# EAGLE design UV_Controller (EAGLE 9.6.2)
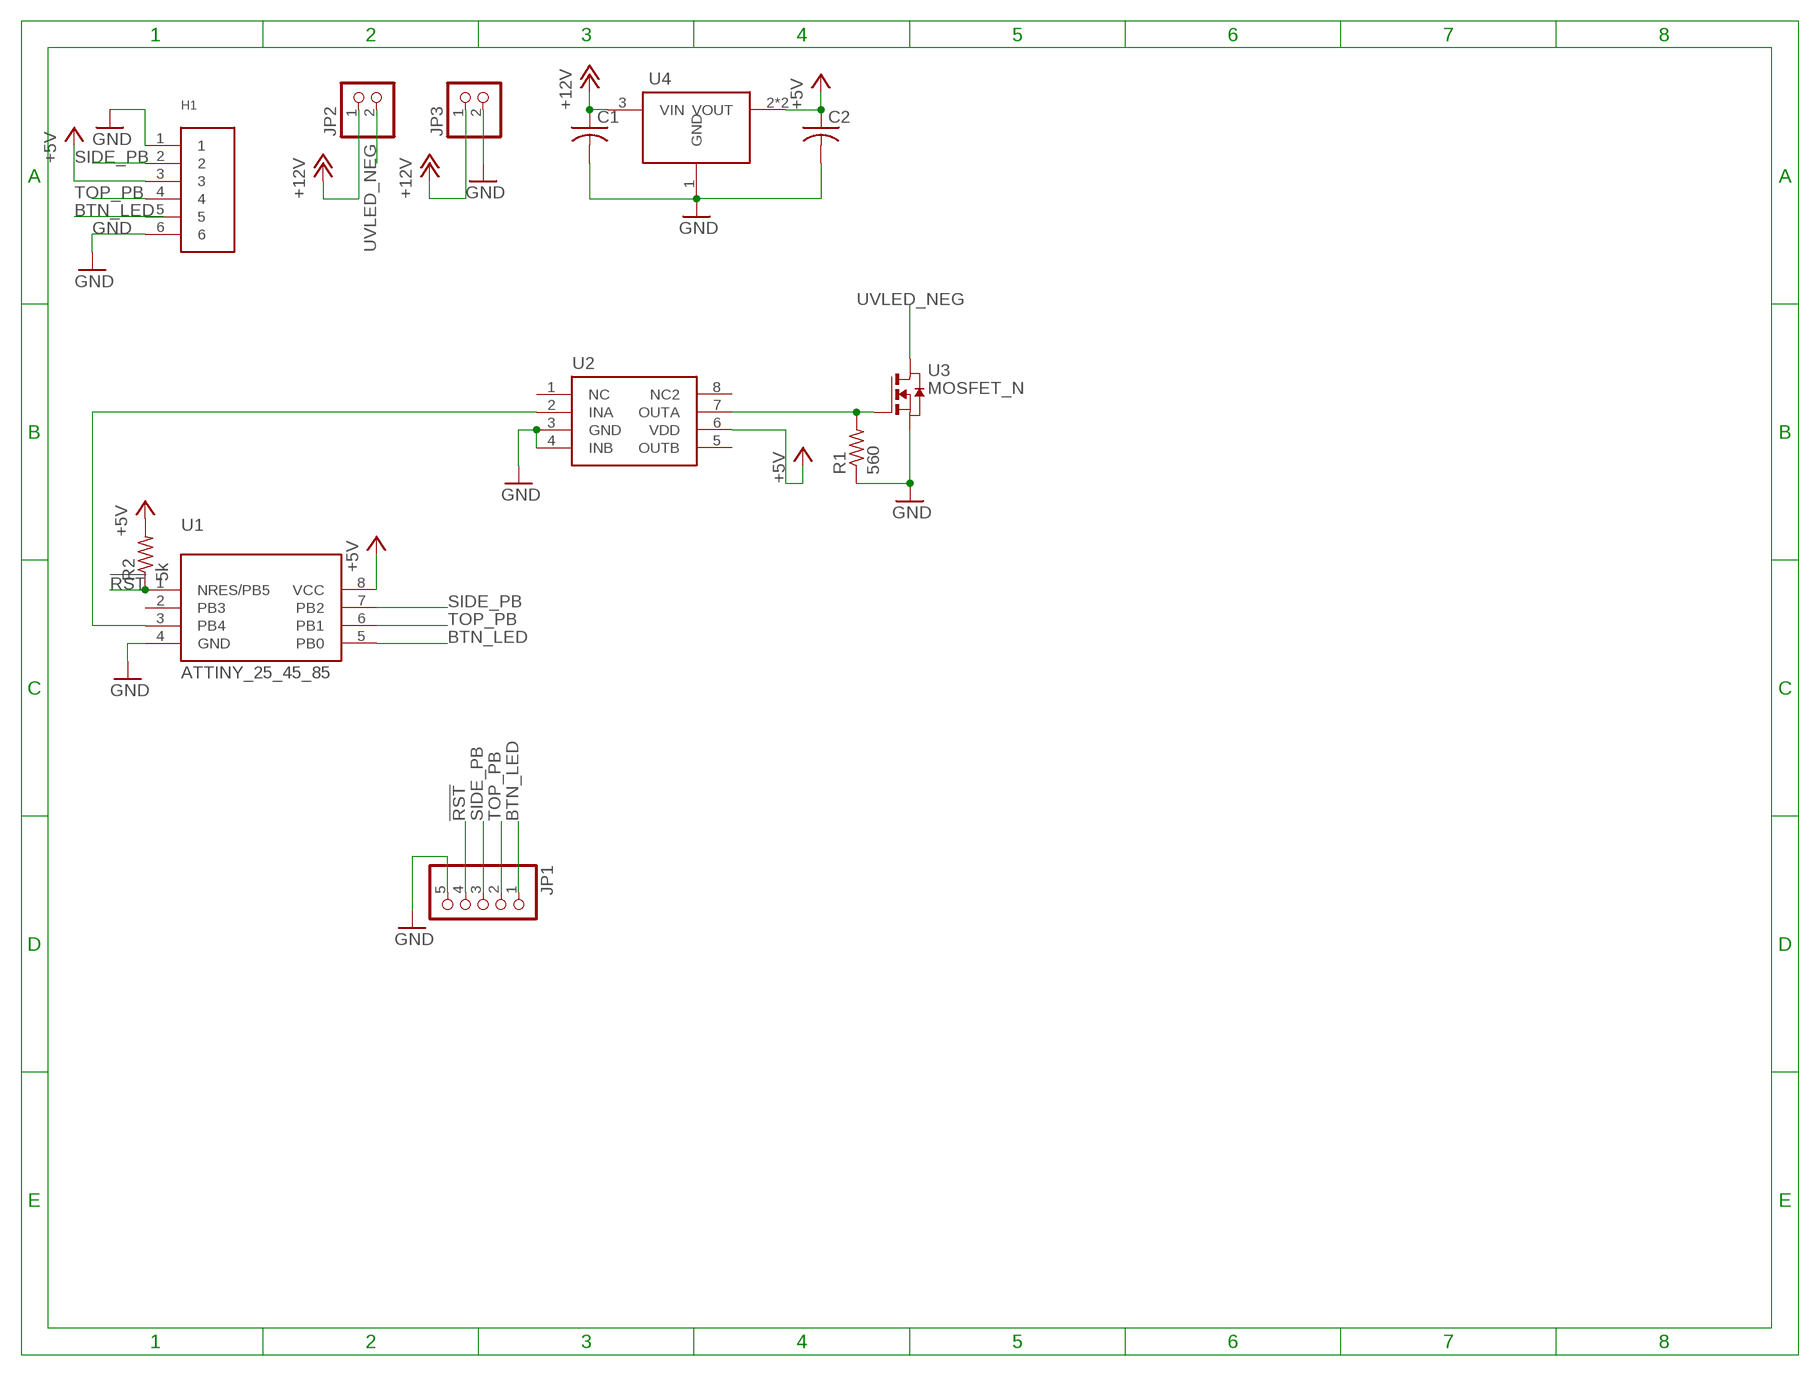
[diagram p0: schematic, sheet 1]

## Parts
C1  C-USC0805  [C0805]
C2  C-USC0805  [C0805]
H1  6PIN_RIBBON_CONN_1MM  [6PIN_SMD_CONN_1MM]
JP1  PINHD-1X5  [1X05]
JP2  PINHD-1X2  [1X02]
JP3  PINHD-1X2  [1X02]
R1  560  R-US_R0805  [R0805]
R2  5k  R-US_R0805  [R0805]
U1  ATTINY_25_45_85  [SOIC-8]
U2  TC427  [SOIC-8]
U3  MOSFET_N  [SOT-23]
U4  NCP1117ST50T3G  [SOT223]

## Nets
!RST: JP1.4 R2.1 U1.1(NRES/PB5)
+5V: C2.1 H1.3 R2.2 U1.8(VCC) U2.6(VDD) U4.2(VOUT) U4.4(VOUT)
+12V: C1.1 JP2.1 JP3.1 U4.3(VIN)
BTN_LED: H1.5 JP1.1 U1.5(PB0)
GND: C1.2 C2.2 H1.1 H1.6 JP1.5 JP3.2 R1.1 U1.4(GND) U2.3(GND) U2.4(INB) U3.3(S) U4.1(GND)
N$1: U1.3(PB4) U2.2(INA)
N$3: R1.2 U2.7(OUTA) U3.2(G)
SIDE_PB: H1.2 JP1.3 U1.7(PB2)
TOP_PB: H1.4 JP1.2 U1.6(PB1)
UVLED_NEG: JP2.2 U3.1(D)
Unconnected: U1.2(PB3) U2.1(NC) U2.5(OUTB) U2.8(NC2)

## Library data of the parts
C1 C2 = DR:C-US: CAPACITOR, American symbol
H1 = DR:6PIN_RIBBON_CONN_1MM
JP1 = pinhead:PINHD-1X5: PIN HEADER
JP2 JP3 = pinhead:PINHD-1X2: PIN HEADER
R1 R2 = DR:R-US_: RESISTOR, American symbol
U1 = DR:ATTINY_25_45_85
U2 = DR:TC427
U3 = DR:MOSFET_N
U4 = DR:NCP1117ST50T3G

## Board
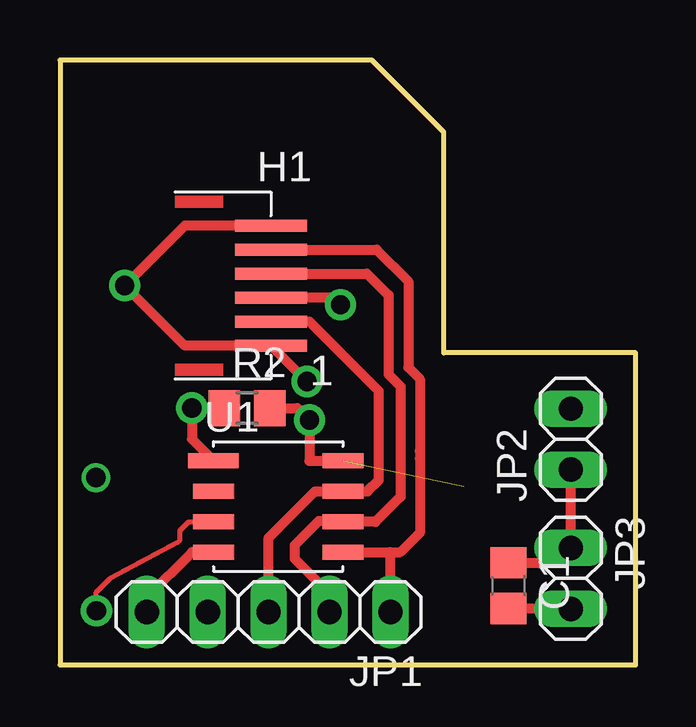
[diagram p1: board, top side]
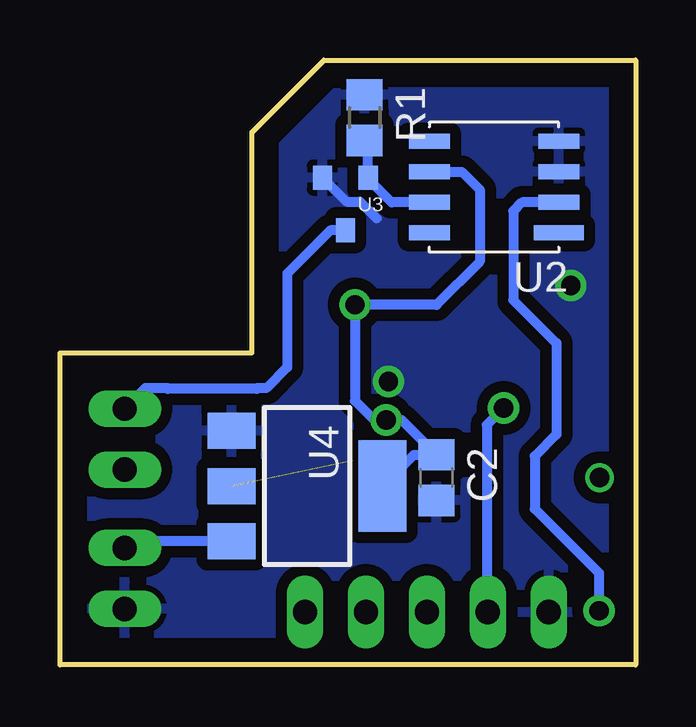
[diagram p2: board, bottom side, seen from below]

Size 24 x 25.2 mm. Coordinates in mm from the lower left corner, seen from the top.
Outline: 0,0 24,0 24,13 16,13 16,22.2 13,25.2 0,25.2 0,0
Copper layers (1*16): Top 0.035mm / dielectric 1.5mm / Bottom 0.035mm
Design rules "default": minimum track width 6mil, minimum drill 0.35mm, track to track 6mil, track to pad 6mil, pad to pad 6mil, via to via 6mil, smd to smd 6mil, copper to edge 40mil, drill to drill 6mil, minimum pad ring 10mil, minimum via ring 8mil, stop-mask expansion 4mil, vias tented up to drill 0mil, thermal gap 10mil
tKeepout: area -2,4.3 to 5,11.3

### Footprints (pad centres in the part's own frame; a part is rotated, then mirrored left to right if it is on the bottom)
C0805 = smd 1.3 x 1.5: 1 -0.95,0; 2 0.95,0
6PIN_SMD_CONN_1MM = smd 3 x 0.5: 1 0,0; 2 0,-1; 3 0,-2; 4 0,-3; 5 0,-4; 6 0,-5
1X05 = drill 1.016 long: 1 -5.08,0; 2 -2.54,0; 3 0,0; 4 2.54,0; 5 5.08,0
1X02 = drill 1.016 long: 1 -1.27,0; 2 1.27,0
R0805 = smd 1.3 x 1.5: 1 -0.95,0; 2 0.95,0
SOIC-8 = smd 2.1 x 0.635: 1 0,0 | smd 1.7 x 0.635: 2 0,-1.27; 3 0,-2.54; 4 0,-3.81; 5 5.4,-3.81; 6 5.4,-2.54; 7 5.4,-1.27; 8 5.4,0
SOT-23 = smd 0.8 x 1: 1 0,0.1; 2 -0.95,-2.1; 3 0.95,-2.1
SOT223 = smd 1.5 x 2: 1 -2.3,-3.15; 2 0,-3.15; 3 2.3,-3.15 | smd 3.8 x 2: 4 0,3.15

### Placement (x,y rotation side)
C1  18.7,3.3 270 top
C2  8.3,7.8 270 bottom
H1  8.8,13.3 180 top
JP1  8.7,2.2 180 top
JP2  21.3,9.4 90 top
JP3  21.3,3.6 270 top
R1  11.3,22.8 270 bottom
R2  7.8,10.7 0 top
U1  6.4,8.5 0 top
U2  3.2,18 180 bottom
U3  12.1,18.2 180 bottom
U4  13.7,7.45 270 bottom

### Tracks (layer width: path | path; a pad name or v marks a point on that pad's centre or on a via)
!RST  (via drill 0.8 pad 1.3)
  Top 0.406: U1.1 5.5,9.4 v5.5,10.7 R2.1
  Bottom 0.406: v5.5,10.7 6.2,10 6.2,2.24 JP1.4
+5V  (via drill 0.8 pad 1.3)  (1 unrouted)
  Top 0.406: v11.7,15 11.4,15.3 H1.3 | U1.8 10.4,8.5 v10.4,10.2 9.9,10.7 R2.2
  Bottom 0.406: U2.6 7.24,20.54 6.5,19.8 6.5,16.8 8.3,15 v11.7,15 11.7,11 11,10.3 10.5,10.3 v10.4,10.2 9.75,10.2 C2.1 9.25,8.75 U4.4
+12V
  Top 0.406: JP2.1 JP3.1 20.78,4.25 C1.1
  Bottom 0.406: U4.3 21.12,5.15 JP3.1
BTN_LED
  Top 0.406: U1.5 13.78,4.69 | 13.78,4.69 14.19,4.69 15,5.5 15,8.6 15,8.9 15,11.92 14.53,12.39 14.53,15.97 13.2,17.3 H1.5 | JP1.1 13.78,4.69
GND  (via drill 0.8 pad 1.3)
  Top 0.406: H1.6 5.2,18.3 v2.7,15.8 5.2,13.3 H1.1 v10.3,11.8 | JP3.2 18.72,2.33 C1.2 | JP1.5 3.62,2.82 5.5,4.7 U1.4
  Bottom 0.406: v10.3,11.8 10.3,11.7 | U3.3 12.05,19.3 11.5,19.3 10.8,18.6
  pour Bottom (isolate 0.47): -0.6,-0.5 -0.6,25.7 16.5,25.7 16.5,13.4 24.4,13.4 24.4,-0.5
N$1  (via drill 0.8 pad 1.3)
  Top 0.203: U1.3 5.36,5.96 5,5.6 5,5.2 4.9,5.1 2.1,3.6 1.52,3.02 v1.52,2.25 1.5,2.27
  Bottom 0.406: U2.2 4.73,19.27 5.1,18.9 5.1,15.2 3.3,13.4 3.3,9.6 4.2,8.7 4.2,6.5 1.52,3.82 v1.52,2.25
N$2  (via drill 0.8)
  other vias: 1.5,7.8
N$3
  Bottom 0.406: U2.7 10.17,19.27 11.15,20.25 U3.2 11.15,21.7 R1.2
SIDE_PB
  Top 0.406: H1.2 10.4,14.3 13.3,11.4 13.3,7.7 12.83,7.23 12.2,7.23 U1.7 10.63,7.23 8.7,5.3 JP1.3
TOP_PB
  Top 0.406: H1.4 12.8,16.3 13.7,15.4 13.7,12.1 14.2,11.6 14.2,7 13.16,5.96 12.46,5.96 12.1,5.96 | 12.1,5.96 U1.6 | JP1.2 10.7,2.74 10.7,3.5 9.8,4.4 9.8,5 10.8,6 12.06,6 12.1,5.96
UVLED_NEG
  Bottom 0.406: U3.1 12.73,18.1 14.53,16.3 14.53,12.39 15.39,11.53 15.77,11.53 15.8,11.5 19.5,11.5 19.53,11.53 20.44,11.53 JP2.2